# Altium schematic sheet CON_PS2PORT_MINIDIN6F_BLACK.SchDoc: PS2 MINIDIN6F Connector (Black)
size A4; Organization: Altium Limited.; Address1: Level 3, 12a Rodborough Rd; Address2: Frenchs Forest 2086; Address3: NSW; Address4: AUSTRALIA; DocumentNumber: 55; SheetNumber: 56; SheetTotal: 77
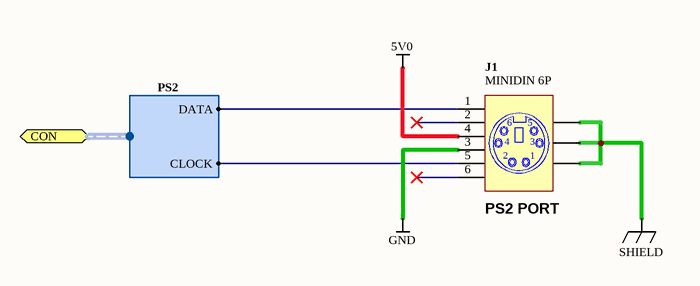
[diagram p0: CON_PS2PORT_MINIDIN6F_BLACK.SchDoc]

## Parts
J1  MINIDIN 6P  [MINIDIN6PURPLE]

## Ports
CON (harness PS2)

## Harnesses
PS2: DATA, CLOCK

## Nets
5V0: J1.4
GND: J1.3
SHIELD: J1.MH1 J1.MH2 J1.MH3
NetJ1_1: J1.1 ; port CON.DATA
NetJ1_5: J1.5 ; port CON.CLOCK

Not connected (* = marked no-connect by the designer): J1 2* 6*

## Notes on the sheet
- (near J1) PS2 PORT
- Sheet Title
- Project Title
- Size:
- Date:
- A4
- Assy:
- Time:
- Revision:
- Sheet
- of
- File:

## Library data of the parts
J1 = D-300-0124: MINI DIN R/A F/SHLD 6P GOLD PLATED; Black; Connector type: Right Angle; Max Current: 2A; Mounting Technology: Through-Hole; Pin Count: 6; Status: Unreleased; Category: Connector